# EAGLE design arena-B (EAGLE 5.06)
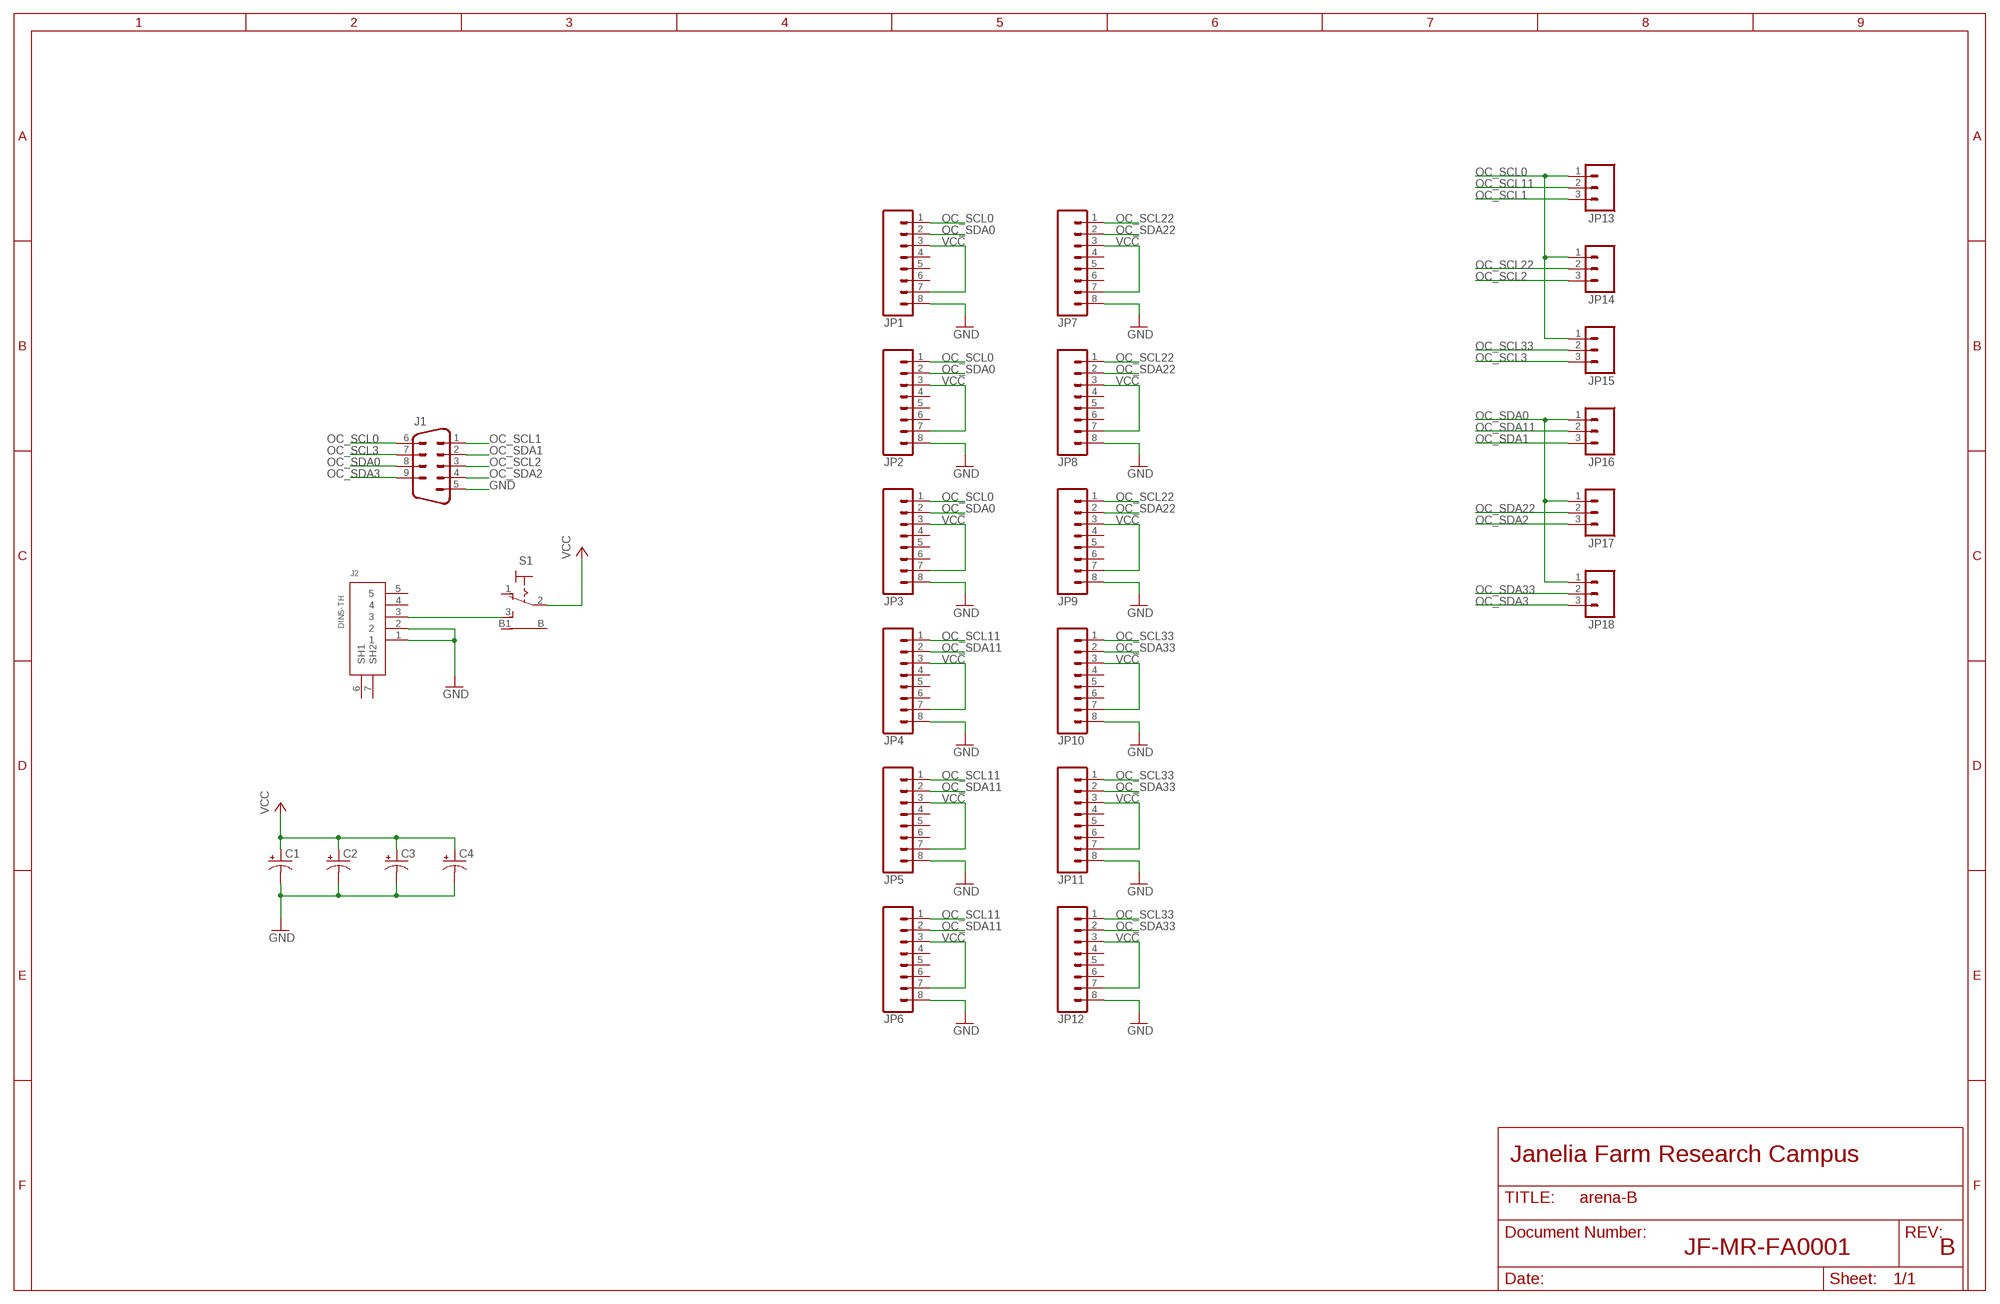
[diagram p0: schematic, sheet 1]

## Parts
C1  CPOL-USE5-10.5  [E5-10,5]
C2  CPOL-USE5-10.5  [E5-10,5]
C3  CPOL-USE5-10.5  [E5-10,5]
C4  CPOL-USE5-10.5  [E5-10,5]
J1  M09HP  [M09HP]
J2  DIN5-TH  [DIN5-TH]
JP1  M08  [1X08]
JP2  M08  [1X08]
JP3  M08  [1X08]
JP4  M08  [1X08]
JP5  M08  [1X08]
JP6  M08  [1X08]
JP7  M08  [1X08]
JP8  M08  [1X08]
JP9  M08  [1X08]
JP10  M08  [1X08]
JP11  M08  [1X08]
JP12  M08  [1X08]
JP13  M03PTH  [1X03]
JP14  M03PTH  [1X03]
JP15  M03PTH  [1X03]
JP16  M03PTH  [1X03]
JP17  M03PTH  [1X03]
JP18  M03PTH  [1X03]
S1  LPV-1  [LPV-1]

## Nets
GND: C1.- C2.- C3.- C4.- J1.5 J2.1 J2.2 JP1.8 JP2.8 JP3.8 JP4.8 JP5.8 JP6.8 JP7.8 JP8.8 JP9.8 JP10.8 JP11.8 JP12.8
N$1: J2.3 S1.3(S)
OC_SCL0: J1.6 JP1.1 JP2.1 JP3.1 JP13.1 JP14.1 JP15.1
OC_SCL1: J1.1 JP13.3
OC_SCL2: J1.3 JP14.3
OC_SCL3: J1.7 JP15.3
OC_SCL11: JP4.1 JP5.1 JP6.1 JP13.2
OC_SCL22: JP7.1 JP8.1 JP9.1 JP14.2
OC_SCL33: JP10.1 JP11.1 JP12.1 JP15.2
OC_SDA0: J1.8 JP1.2 JP2.2 JP3.2 JP16.1 JP17.1 JP18.1
OC_SDA1: J1.2 JP16.3
OC_SDA2: J1.4 JP17.3
OC_SDA3: J1.9 JP18.3
OC_SDA11: JP4.2 JP5.2 JP6.2 JP16.2
OC_SDA22: JP7.2 JP8.2 JP9.2 JP17.2
OC_SDA33: JP10.2 JP11.2 JP12.2 JP18.2
VCC: C1.+ C2.+ C3.+ C4.+ JP1.3 JP1.7 JP2.3 JP2.7 JP3.3 JP3.7 JP4.3 JP4.7 JP5.3 JP5.7 JP6.3 JP6.7 JP7.3 JP7.7 JP8.3 JP8.7 JP9.3 JP9.7 JP10.3 JP10.7 JP11.3 JP11.7 JP12.3 JP12.7 S1.2(P)
Unconnected: J2.4 J2.5 J2.6(SH1) J2.7(SH2) JP1.4 JP1.5 JP1.6 JP2.4 JP2.5 JP2.6 JP3.4 JP3.5 JP3.6 JP4.4 JP4.5 JP4.6 JP5.4 JP5.5 JP5.6 JP6.4 JP6.5 JP6.6 JP7.4 JP7.5 JP7.6 JP8.4 JP8.5 JP8.6 JP9.4 JP9.5 JP9.6 JP10.4 JP10.5 JP10.6 JP11.4 JP11.5 JP11.6 JP12.4 JP12.5 JP12.6 S1.1(O) S1.B S1.B1

## Notes on the sheet
- Janelia Farm Research Campus
- JF-MR-FA0001 | B

## Library data of the parts
C1-C4 = resistor:CPOL-US: POLARIZED CAPACITOR, American symbol
J1 = con-subd:M09: SUB-D
J2 = jfrc:DIN5-TH
JP1-JP12 = jfrc:M08: Header 8 Standard 8-pin 0.1" header. Use with straight break away headers (SKU : PRT-00116), right angle break away headers (PRT-00553), swiss pins (PRT-00743), machine pins (PRT-00117), and female headers (PRT-00115).
JP13-JP18 = SparkFun:M03: Header 3 Standard 3-pin 0.1" header. Use with straight break away headers (SKU : PRT-00116), right angle break away headers (PRT-00553), swiss pins (PRT-00743), machine pins (PRT-00117), and female headers (PRT-00115). Molex polarized connector foot print use with SKU : PRT-08232 with associated crimp pins and housings.
S1 = jfrc:LPV-1: TOGGLE SWITCH

## Board
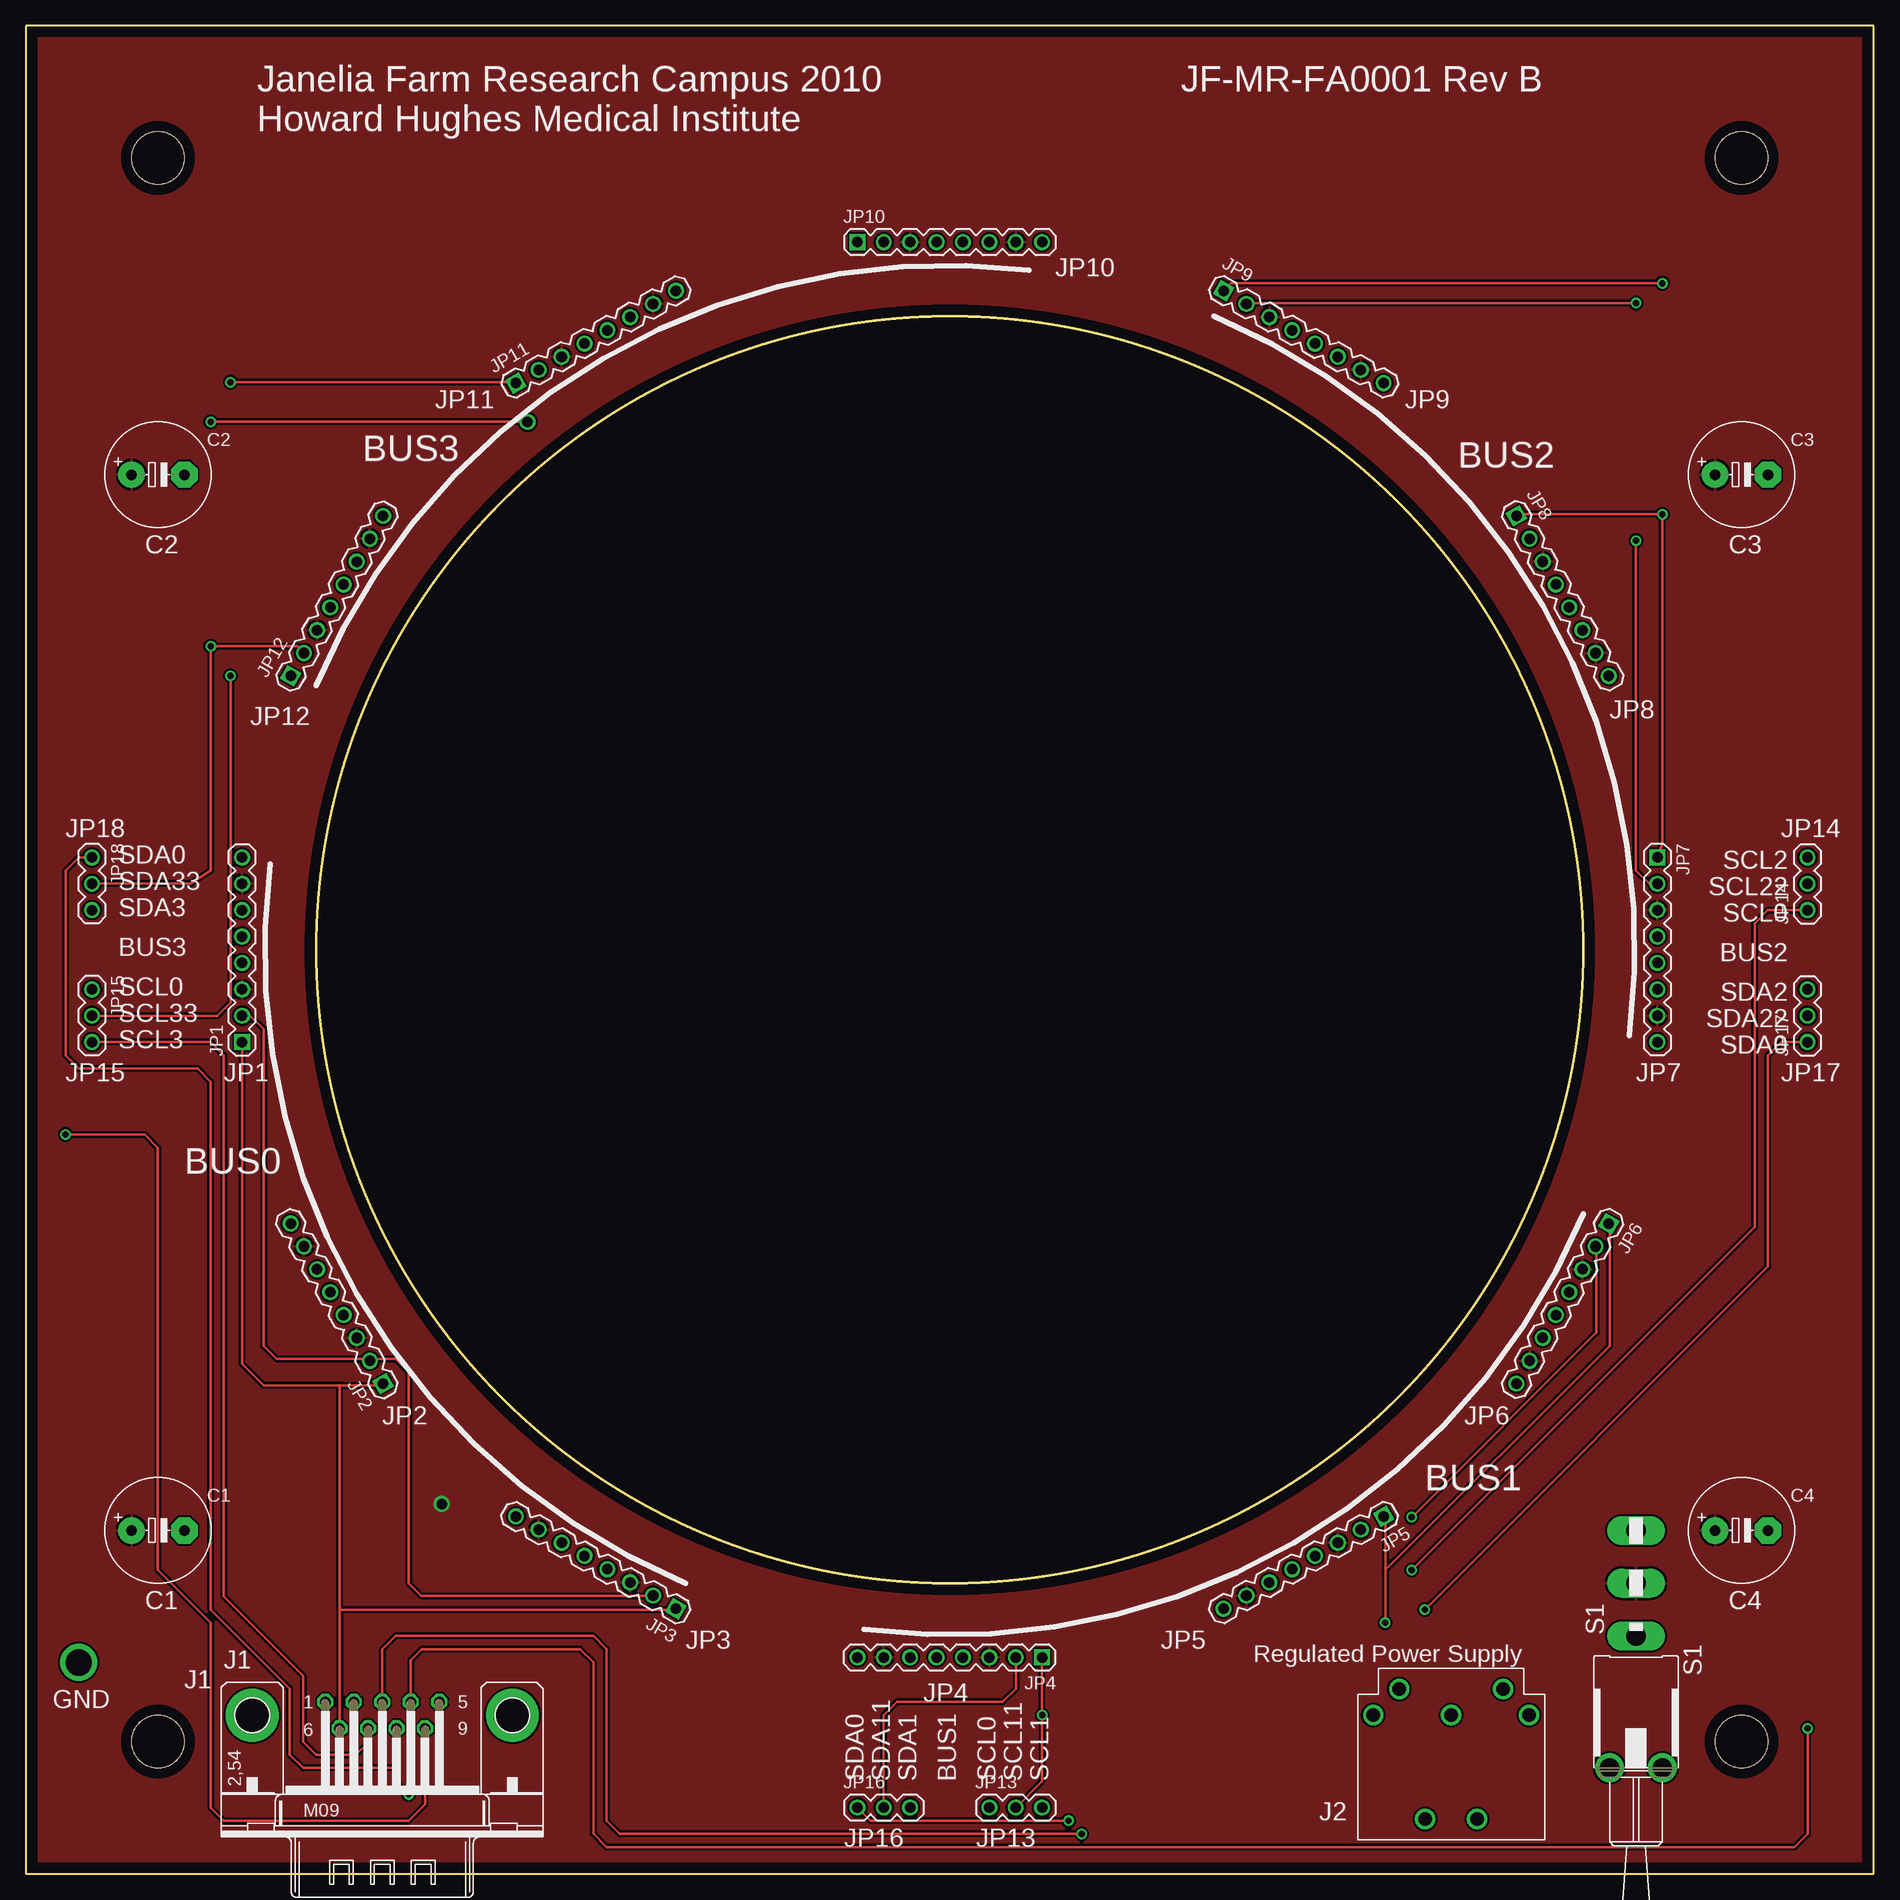
[diagram p1: board, top side]
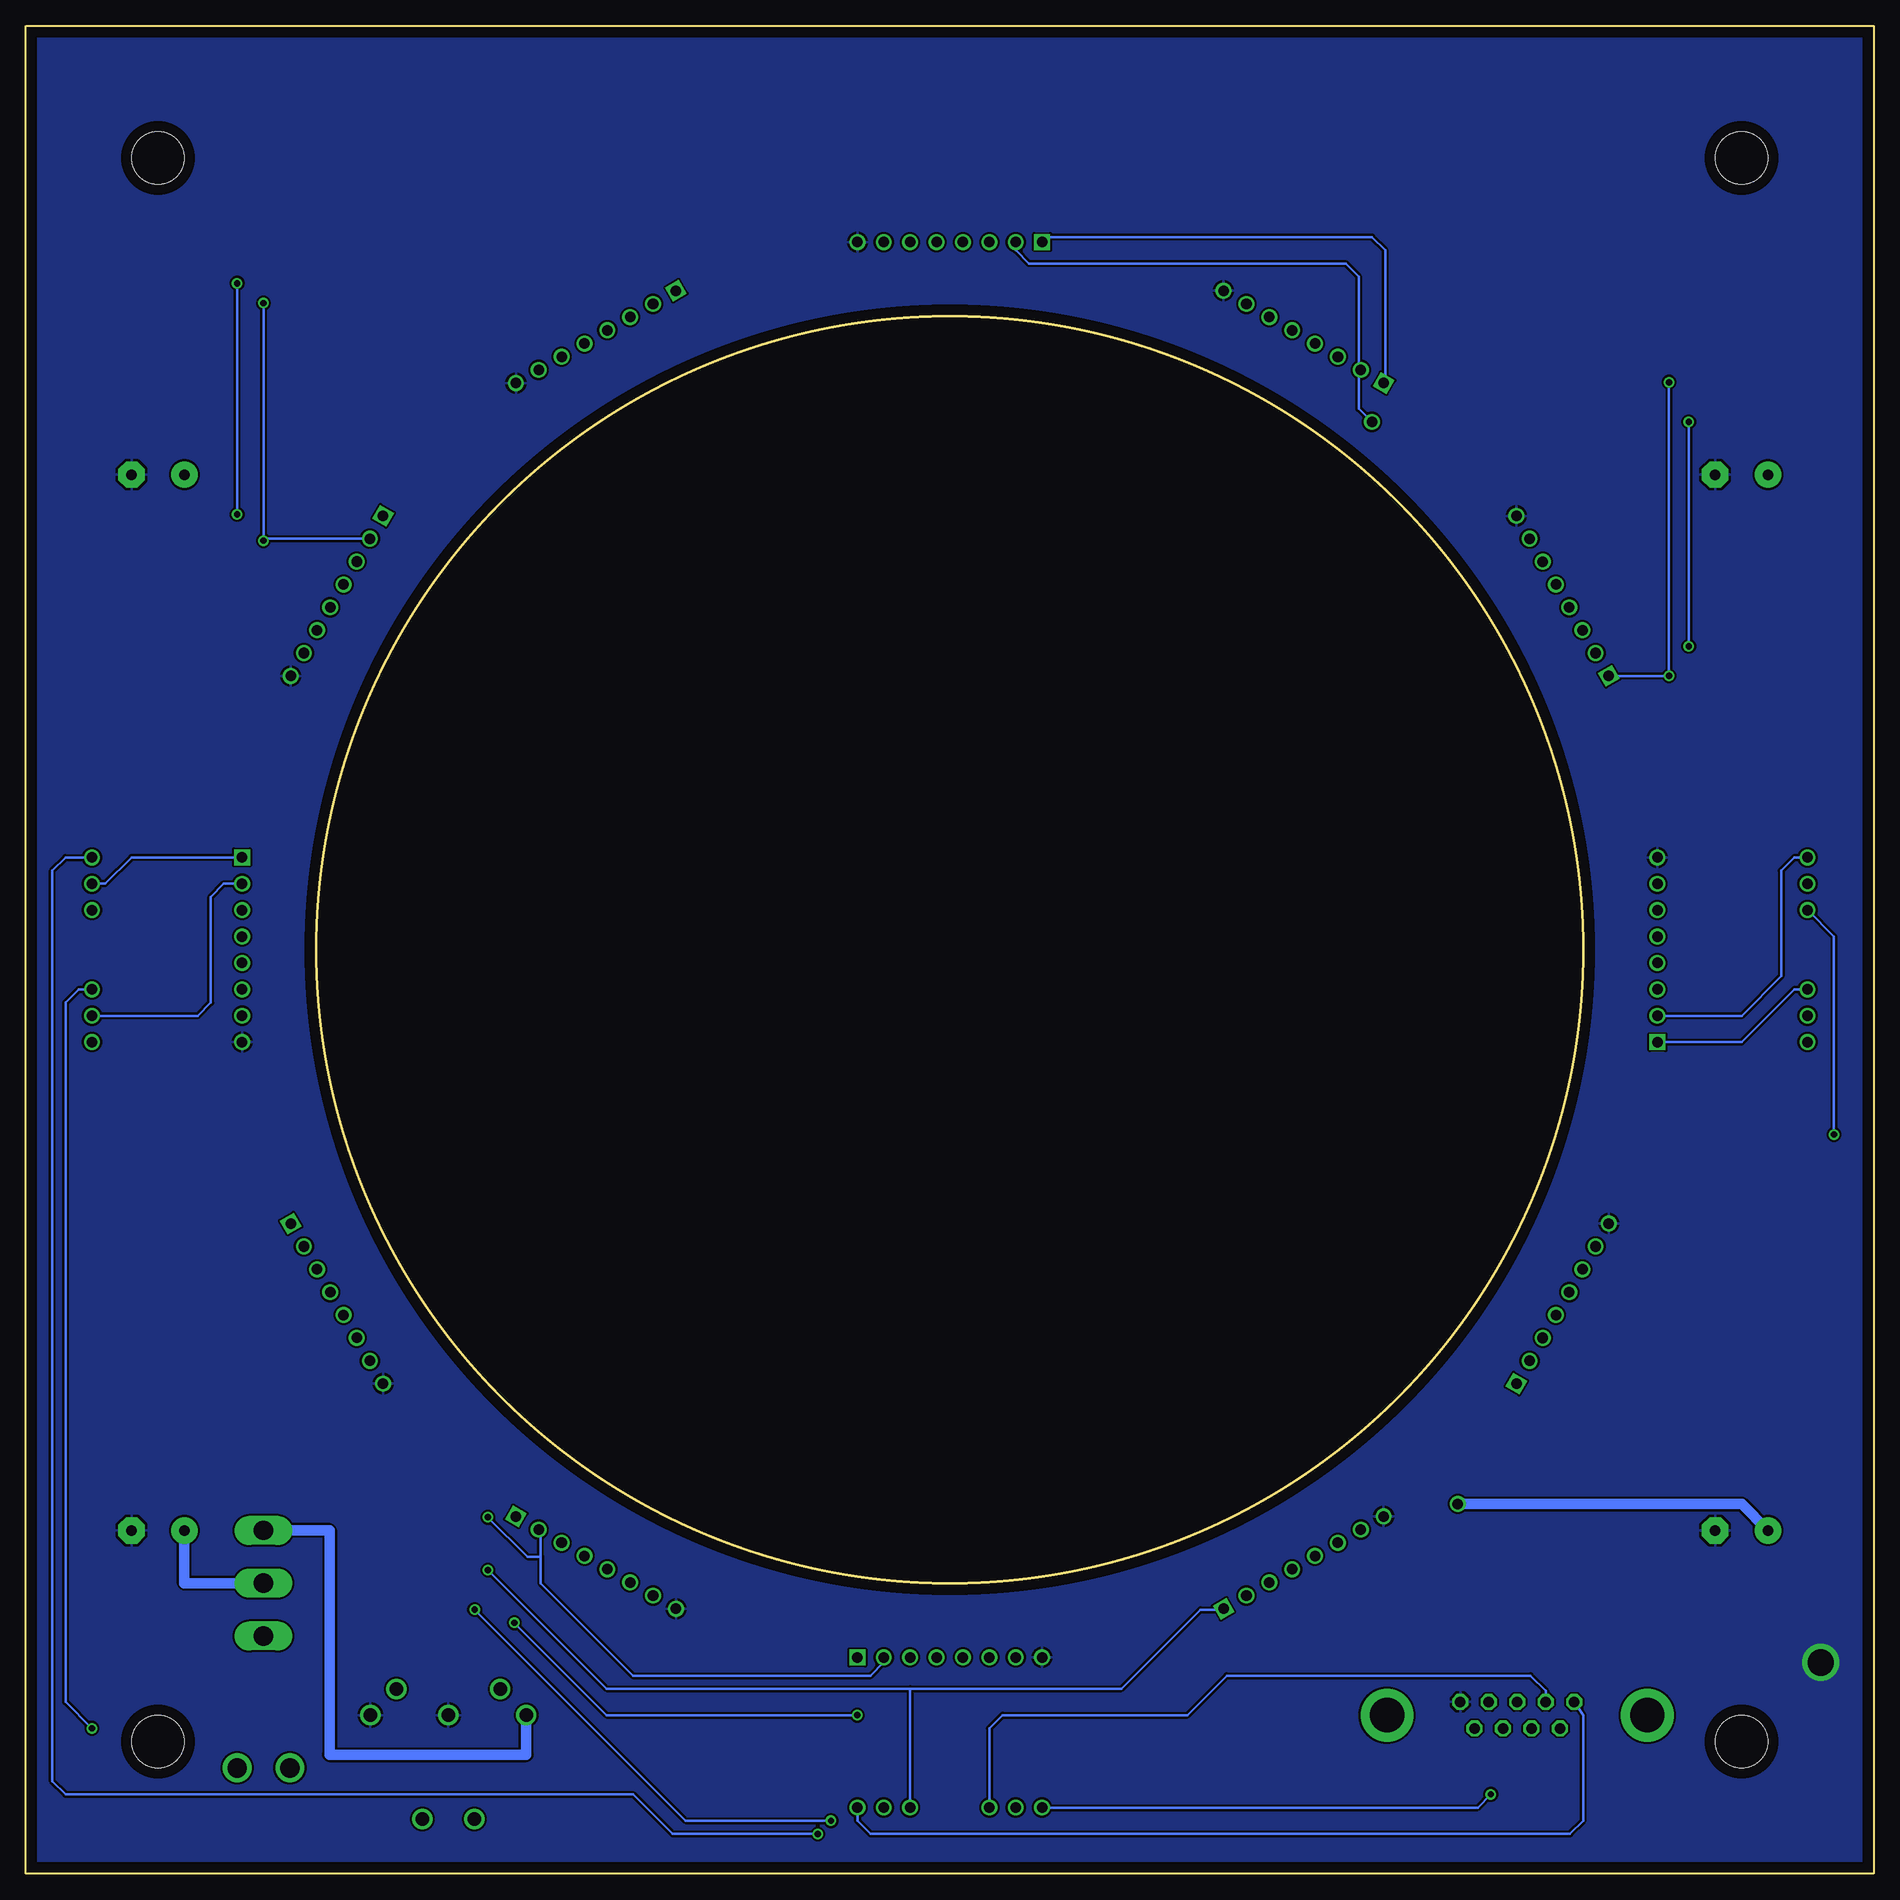
[diagram p2: board, bottom side, seen from below]

Size 177.8 x 177.8 mm. Coordinates in mm from the lower left corner, seen from the top.
Outline: 0,0 177.8,0 177.8,177.8 0,177.8 0,0
Outline: circle at 88.9,88.9 radius 60.96
Copper layers (1*16): Top 0.035mm / dielectric 1.5mm / Bottom 0.035mm
Design rules "default": minimum track width 10mil, minimum drill 24mil, track to track 8mil, track to pad 8mil, pad to pad 8mil, via to via 8mil, smd to smd 8mil, copper to edge 40mil, drill to drill 8mil, minimum pad ring 10mil, minimum via ring 8mil, stop-mask expansion 4mil, vias tented up to drill 0mil, thermal gap 10mil
Holes 5.08 mm at 165.1,12.7 165.1,165.1 12.7,165.1 12.7,12.7
Milling: area 27.9,27.9 to 149.9,149.9

### Footprints (pad centres in the part's own frame; a part is rotated, then mirrored left to right if it is on the bottom)
E5-10,5 = drill 1.016 pad 2.54 round: + -2.54,0 | drill 1.016 pad 2.54 octagon: - 2.54,0
M09HP = drill 1.016 octagon: 1 -5.486,1.27; 2 -2.743,1.27; 3 0,1.27; 4 2.743,1.27; 5 5.486,1.27; 6 -4.115,-1.27; 7 -1.372,-1.27; 8 1.372,-1.27; 9 4.115,-1.27 | drill 3.302 pad 5.08 round: G1 -12.522,0; G2 12.522,0
DIN5-TH = drill 1.3 round: 1 7.5,0; 2 0,0; 3 -7.5,0; 4 5,2.5; 5 -5,2.5; 6 2.5,-10; 7 -2.5,-10
1X08 = drill 1.016 square: 1 -17.78,0 | drill 1.016 round: 2 -15.24,0; 3 -12.7,0; 4 -10.16,0; 5 -7.62,0; 6 -5.08,0; 7 -2.54,0; 8 0,0
1X03 = drill 1.016 round: 1 0,0; 2 2.54,0; 3 5.08,0
LPV-1 = drill 1.854 long: 1 0,12.7; 2 0,17.78; 3 0,22.86 | drill 1.854 round: B -2.54,0; B1 2.54,0

### Placement (x,y rotation side)
C1  12.7,33.02 0 top
C2  12.7,134.62 0 top
C3  165.1,134.62 0 top
C4  165.1,33.02 0 top
J1  34.29,15.24 0 top
J2  137.16,15.24 0 top
JP1  20.8,97.79 90 top
JP2  25.48,62.55 120 top
JP3  47.15,34.37 150 top
JP4  80.01,20.8 180 top
JP5  115.25,25.48 210 top
JP6  143.43,47.15 240 top
JP7  157,80.01 270 top
JP8  152.32,115.25 300 top
JP9  130.65,143.43 330 top
JP10  97.79,157 0 top
JP11  62.55,152.32 30 top
JP12  34.37,130.65 60 top
JP13  92.71,6.35 0 top
JP14  171.45,92.71 90 top
JP15  6.35,85.09 270 top
JP16  80.01,6.35 0 top
JP17  171.45,80.01 90 top
JP18  6.35,97.79 270 top
S1  154.94,10.16 0 top

### Tracks (layer width: path | path; a pad name or v marks a point on that pad's centre or on a via)
GND  (via drill 2.54)
  other vias: 5.08,20.32
  pour Bottom: 0,0 0,177.8 177.8,177.8 177.8,0
N$1
  Bottom 1.016: S1.3 148.59,33.02 148.59,11.43 129.66,11.43 J2.3
OC_SCL0  (via drill 0.61)
  Top 0.254: 30.48,46.99 34.29,46.99 JP2.1 | 30.48,46.99 22.86,46.99 20.8,49.05 JP1.1 | JP14.1 167.64,92.71 166.37,91.44 166.37,62.23 v133.35,29.21 | JP3.1 62.23,25.4 30.18,25.4 | 30.18,25.4 30.18,46.99 30.48,46.99 | 30.18,25.4 J1.6
  Bottom 0.254: JP15.1 7.62,85.09 12.7,80.01 JP1.1 | 92.71,17.78 JP13.1 | 92.71,17.78 72.39,17.78 64.77,25.4 62.23,25.4 JP3.1 | v133.35,29.21 121.92,17.78 92.71,17.78
OC_SCL1
  Bottom 0.254: JP13.3 97.79,5.08 96.52,3.81 29.21,3.81 27.94,5.08 27.94,15.24 J1.1
OC_SCL2  (via drill 0.61)
  Top 0.254: J1.3 34.29,21.59 35.56,22.86 54.61,22.86 55.88,21.59 55.88,5.08 57.15,3.81 v101.6,3.81
  Bottom 0.254: v101.6,3.81 115.57,3.81 119.38,7.62 173.99,7.62 175.26,8.89 175.26,96.52 173.99,97.79 JP14.3
OC_SCL3
  Top 0.254: JP15.3 17.78,80.01 19.05,78.74 19.05,26.67 26.67,19.05 26.67,12.7 27.94,11.43 31.75,11.43 32.92,12.6 J1.7
OC_SCL11  (via drill 0.61)
  Top 0.254: JP13.2 97.79,8.89 v97.79,15.24 JP4.1 | 130.81,29.21 152.4,50.8 152.4,62.47 JP6.1 | 130.81,29.21 v130.81,24.13 | 130.81,29.21 130.81,34.21 JP5.1
  Bottom 0.254: v130.81,24.13 121.92,15.24 v97.79,15.24
OC_SCL22  (via drill 0.61)
  Top 0.254: JP7.1 157.48,99.06 v157.48,130.81 143.51,130.81 JP8.1 | JP9.1 115.96,153.04 v157.48,153.04
  Bottom 0.254: JP14.2 170.18,95.25 167.64,97.79 JP7.1 | JP8.1 143.51,130.81 | v157.48,130.81 v157.48,153.04
OC_SCL33  (via drill 0.61)
  Top 0.254: JP15.2 18.42,82.55 19.69,83.82 v19.69,115.25 | v19.69,143.51 46.99,143.51 JP11.1
  Bottom 0.254: JP11.1 46.99,143.51 46.99,156.21 48.26,157.48 80.01,157.48 JP10.1 | JP12.1 v19.69,115.25 v19.69,143.51
OC_SDA0  (via drill 0.61)
  Top 0.254: JP18.1 5.08,97.79 3.81,96.52 3.81,78.74 5.08,77.47 16.51,77.47 17.78,76.2 17.78,25.4 25.4,17.78 25.4,11.43 26.67,10.16 35.66,10.16 | JP17.1 168.91,80.01 167.64,78.74 167.64,58.42 v134.62,25.4 | v100.33,5.08 81.28,5.08 JP16.1 | v36.83,7.62 35.66,8.79 35.66,10.16 | 35.66,10.16 J1.8 | JP1.2 21.59,82.55 22.86,81.28 22.86,50.8 24.13,49.53 32.92,49.53 JP2.2 33.28,49.53 35.56,49.53 36.83,48.26 36.83,27.94 38.02,26.75 JP3.2
  Bottom 0.254: JP16.1 38.1,6.35 v36.83,7.62 | v134.62,25.4 114.3,5.08 v100.33,5.08 | JP1.2 12.7,82.55 8.89,86.36 8.89,96.52 7.62,97.79 JP18.1
OC_SDA1
  Bottom 0.254: JP16.3 85.09,13.97 83.82,15.24 66.04,15.24 62.23,19.05 33.02,19.05 31.55,17.58 J1.2
OC_SDA2  (via drill 0.61)
  Top 0.254: v171.45,13.97 171.45,3.81 170.18,2.54 55.88,2.54 54.61,3.81 54.61,20.32 53.34,21.59 38.1,21.59 37.03,20.52 J1.4
  Bottom 0.254: v171.45,13.97 173.99,16.51 173.99,83.82 172.72,85.09 JP17.3
OC_SDA3  (via drill 0.61)
  Top 0.254: J1.9 38.41,6.66 36.83,5.08 19.05,5.08 17.78,6.35 17.78,24.13 12.7,29.21 12.7,69.85 11.43,71.12 v3.81,71.12
  Bottom 0.254: v3.81,71.12 3.81,90.17 JP18.3
OC_SDA11  (via drill 0.61)
  Top 0.254: JP16.2 82.55,15.24 83.82,16.51 93.98,16.51 95.25,17.78 JP4.2 | v133.35,34.29 151.13,52.07 151.13,59.69 JP6.2
  Bottom 0.254: 128.27,30.48 128.27,27.94 119.38,19.05 96.52,19.05 95.25,20.32 JP4.2 | 128.27,30.48 128.27,33.02 JP5.2 | v133.35,34.29 129.54,30.48 128.27,30.48
OC_SDA22  (via drill 0.61)
  Top 0.254: v154.94,151.13 118.11,151.13 JP9.2 | JP7.2 156.21,95.25 154.94,96.52 v154.94,128.27
  Bottom 0.254: JP17.2 161.29,82.55 160.02,83.82 160.02,93.98 158.75,95.25 JP7.2 | v154.94,151.13 v154.94,128.27 154.94,128.45 JP8.2
OC_SDA33  (via drill 0.61, 1.02)
  Top 0.254: JP18.2 15.88,95.25 17.78,96.52 v17.78,118.11 26.09,118.11 JP12.2 | v48.26,139.7 v17.78,139.7
  Bottom 0.254: 49.53,143.51 49.53,144.78 JP11.2 | v48.26,139.7 49.53,140.97 49.53,143.51 | 49.53,143.51 49.53,153.67 50.8,154.94 81.28,154.94 82.55,156.21 JP10.2 82.55,157.48 | v17.78,139.7 v17.78,118.11
VCC  (via drill 1.02)
  Bottom 1.016: S1.2 162.56,27.94 C4.+ | C1.+ 12.7,35.56 v40.01,35.56
  pour Top: 0,0 0,177.8 177.8,177.8 177.8,0

### Text on the board
tPlace: Janelia Farm Research Campus 2010 | JF-MR-FA0001 Rev B | Howard Hughes Medical Institute | JP10 | JP11 | JP9 | BUS3 | BUS2 | C2 | C3 | JP12 | JP8 | JP18 | JP14 | SCL2 | SDA0 | SCL22 | SDA33 | SCL0 | SDA3 | BUS2 | BUS3 | SDA2 | SCL0 | SDA22 | SCL33 | SDA0 | SCL3 | JP15 | JP1 | JP7 | JP17 | BUS0 | JP2 | JP6 | BUS1 | C1 | C4 | JP3 | JP5 | Regulated Power Supply | S1 | J1 | JP4 | GND | SDA0 | SDA11 | SDA1 | BUS1 | SCL0 | SCL11 | SCL1 | J2 | JP16 | JP13